# EAGLE design CAN-WiFi-GW-DevBoard (EAGLE 9.6.2)
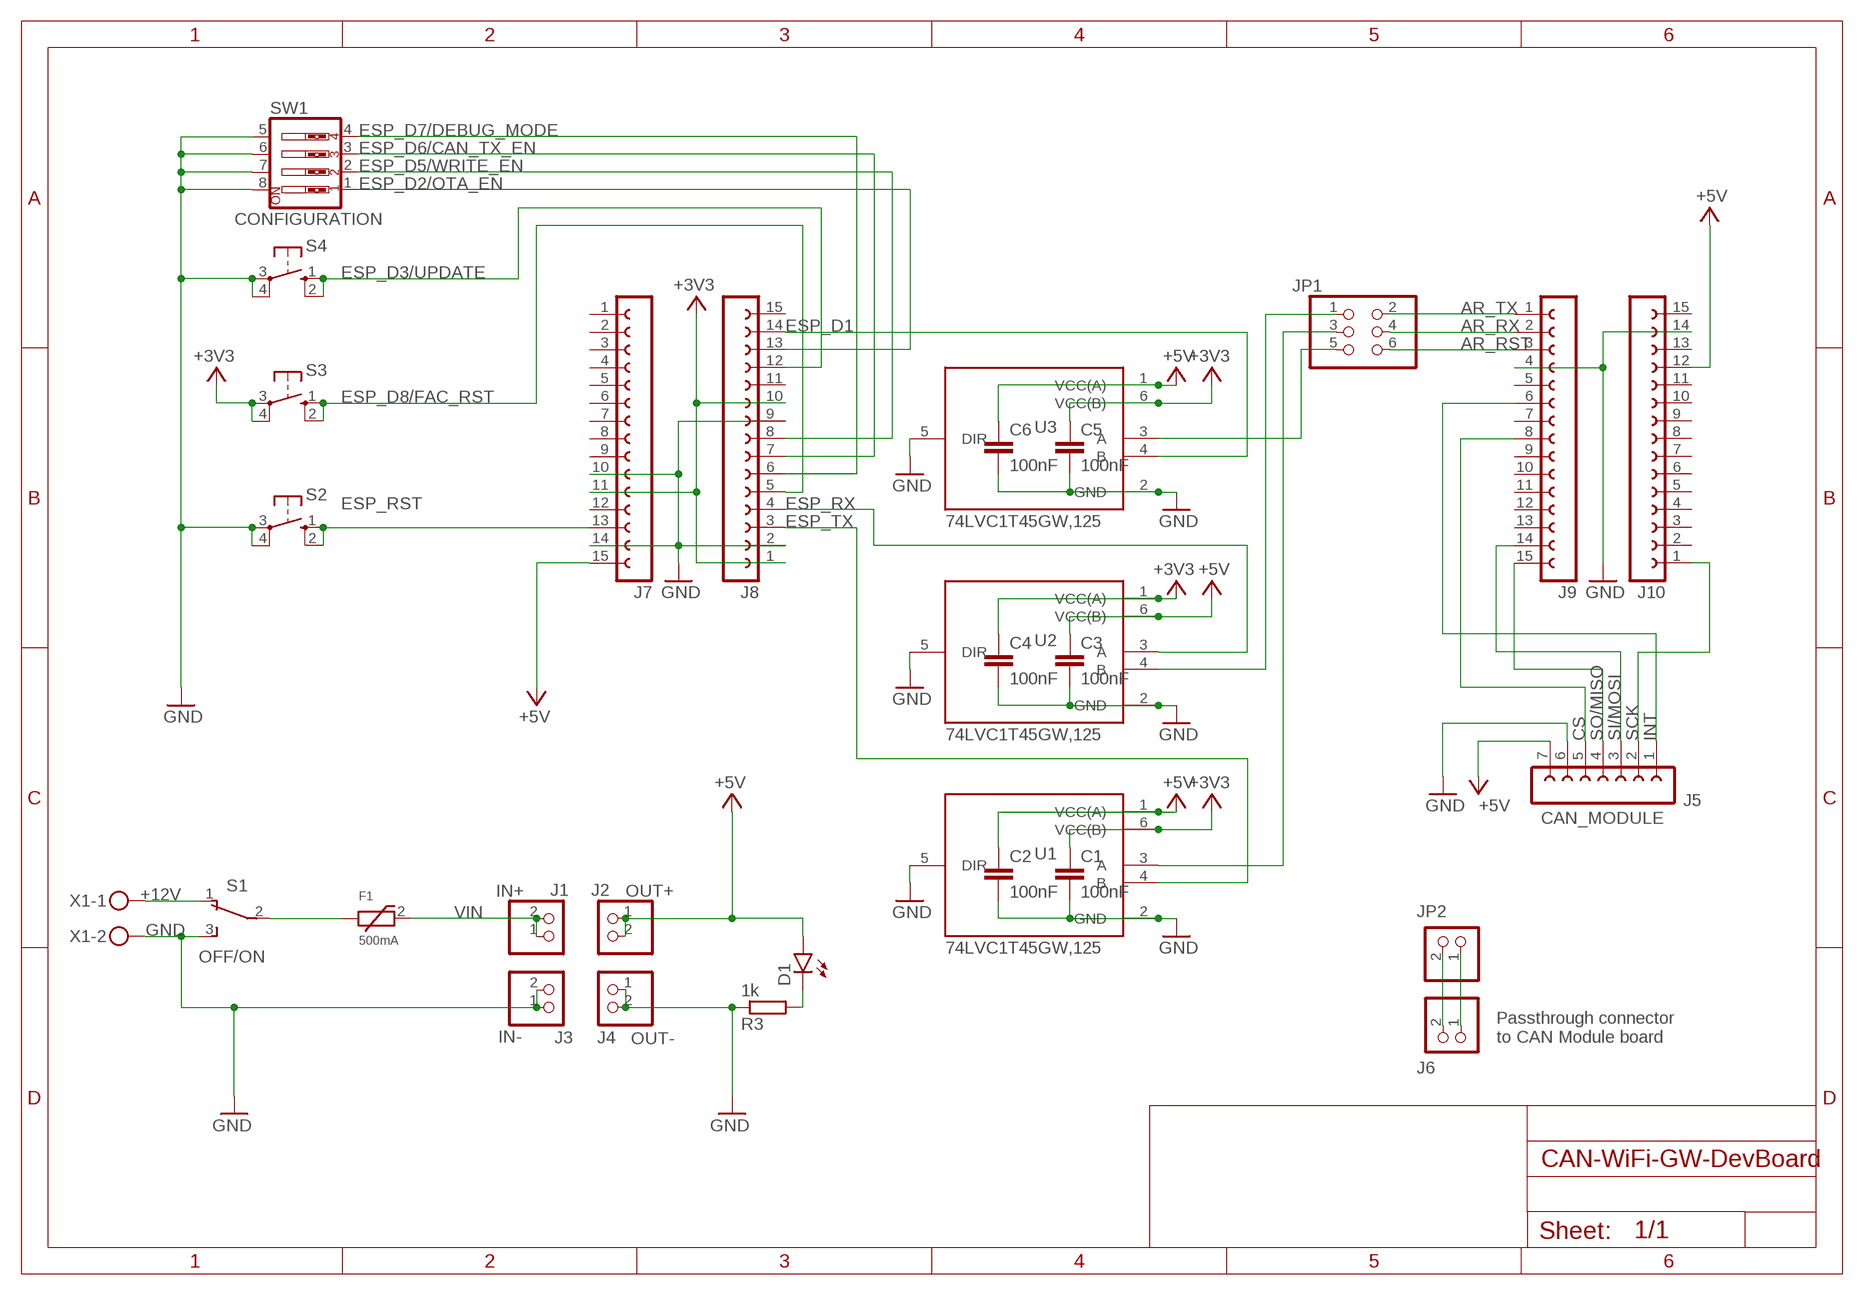
[diagram p0: schematic, sheet 1]

## Parts
C1  100nF  C-EUC1206  [C1206]
C2  100nF  C-EUC1206  [C1206]
C3  100nF  C-EUC1206  [C1206]
C4  100nF  C-EUC1206  [C1206]
C5  100nF  C-EUC1206  [C1206]
C6  100nF  C-EUC1206  [C1206]
D1  LEDSML0805  [SML0805]
F1  500mA  PTC-FUSE  [FSMD050-1210-R]
J1  IN+  PINHD-1X2  [1X02]
J2  OUT+  PINHD-1X2  [1X02]
J3  IN-  PINHD-1X2  [1X02]
J4  OUT-  PINHD-1X2  [1X02]
J5  CAN_MODULE  FE07-1  [FE07]
J6  PINHD-1X2  [1X02]
J7  FE15-1  [FE15]
J8  FE15-1  [FE15]
J9  FE15-1  [FE15]
J10  FE15-1  [FE15]
JP1  PINHD-2X3  [2X03]
JP2  PINHD-1X2  [1X02]
R3  1k  R-EU_R0805  [R0805]
S1  OFF/ON  TL36PO  [TL3XPO]
S2  10-XX  [B3F-10XX]
S3  10-XX  [B3F-10XX]
S4  10-XX  [B3F-10XX]
SW1  CONFIGURATION  SW_DIP-4  [EDG-04]
U1  74LVC1T45GW,125  [SOP65P210X110-6N]
U2  74LVC1T45GW,125  [SOP65P210X110-6N]
U3  74LVC1T45GW,125  [SOP65P210X110-6N]
X1  MKDSN1,5/2-5,08  [MKDSN1,5/2-5,08]

## Nets
+3V3: C1.1 C4.1 C5.1 J7.11 J8.1 J8.10 S3.3(P) S3.4(P1) U1.6(VCC(B)) U2.1(VCC(A)) U3.6(VCC(B))
+5V: C2.1 C3.1 C6.1 D1.A J2.1 J2.2 J5.7 J7.15 J10.12 U1.1(VCC(A)) U2.6(VCC(B)) U3.1(VCC(A))
+12V: S1.1(O) X1.1
AR_RST: J9.3 JP1.6
AR_RX: J9.2 JP1.4
AR_TX: J9.1 JP1.2
CS: J5.5 J9.8
ESP_D1: J8.14 U3.4(B)
ESP_D2/OTA_EN: J8.13 SW1.1
ESP_D3/UPDATE: J8.12 S4.1(S) S4.2(S1)
ESP_D5/WRITE_EN: J8.8 SW1.2
ESP_D6/CAN_TX_EN: J8.7 SW1.3
ESP_D7/DEBUG_MODE: J8.6 SW1.4
ESP_D8/FAC_RST: J8.5 S3.1(S) S3.2(S1)
ESP_RST: J7.13 S2.1(S) S2.2(S1)
ESP_RX: J8.4 U2.3(A)
ESP_RX_5V: JP1.1 U2.4(B)
ESP_TX: J8.3 U1.4(B)
ESP_TX_5V: JP1.3 U1.3(A)
GND: C1.2 C2.2 C3.2 C4.2 C5.2 C6.2 J3.1 J3.2 J4.1 J4.2 J5.6 J7.10 J7.14 J8.2 J8.9 J9.4 J10.14 R3.1 S1.3(S) S2.3(P) S2.4(P1) S4.3(P) S4.4(P1) SW1.5 SW1.6 SW1.7 SW1.8 U1.2(GND) U1.5(DIR) U2.2(GND) U2.5(DIR) U3.2(GND) U3.5(DIR) X1.2
INT: J5.1 J9.6
N$1: D1.C R3.2
N$2: J6.1 JP2.1
N$3: J6.2 JP2.2
N$4: F1.1 S1.2(P)
N$6: JP1.5 U3.3(A)
SCK: J5.2 J10.1
SI/MOSI: J5.3 J9.14
SO/MISO: J5.4 J9.15
VIN: F1.2 J1.1 J1.2
Unconnected: J7.1 J7.2 J7.3 J7.4 J7.5 J7.6 J7.7 J7.8 J7.9 J7.12 J8.11 J8.15 J9.5 J9.7 J9.9 J9.10 J9.11 J9.12 J9.13 J10.2 J10.3 J10.4 J10.5 J10.6 J10.7 J10.8 J10.9 J10.10 J10.11 J10.13 J10.15

## Notes on the sheet
- Passthrough connector
  to CAN Module board

## Library data of the parts
C1-C6 = rcl:C-EU: CAPACITOR, European symbol; SPICEPREFIX: C
D1 = led:LED: LED OSRAM: - CHIPLED LG R971, LG N971, LY N971, LG Q971, LY Q971, LO R971, LY R971 LH N974, LH R974 LS Q976, LO Q976, LY Q976 LO Q996 - Hyper CHIPLED LW Q18S LB Q993, LB Q99A, LB R99A - SideLED LS A670, LO A670, LY A670, LG A670, LP A670 LB A673, LV A673, LT A673, LW A673 LH A674 LY A675 LS A676, LA A676, LO A676, LY A676, LW A676 LS A679, LY A679, LG A679 - Hyper Micro SIDELED® LS Y876, LA Y876, LO Y876, LY Y876 LT Y87S - SmartLED LW L88C, LW L88S LB L89C, LB L89S, LG L890 LS L89K, LO L89K, LY L89K LS L896, LA L896, LO L896, LY L896 - TOPLED LS T670, LO T670, LY T670, LG T670, LP T670 LSG T670, LSP T670, LSY T670, LOP T670, LYG T670 LG T671, LOG T671, LSG T671 LB T673, LV T673, LT T673, LW T673 LH T674 LS T676, LA T676, LO T676, LY T676, LB T676, LH T676, LSB T676, LW T676 LB T67C, LV T67C, LT T67C, LS T67K, LO T67K, LY T67K, LW E67C LS E67B, LA E67B, LO E67B, LY E67B, LB E67C, LV E67C, LT E67C LW T67C LS T679, LY T679, LG T679 LS T770, LO T770, LY T770, LG T770, LP T770 LB T773, LV T773, LT T773, LW T773 LH T774 LS E675, LA E675, LY E675, LS T675 LS T776, LA T776, LO T776, LY T776, LB T776 LHGB T686 LT T68C, LB T68C - Hyper Mini TOPLED® LB M676 - Mini TOPLED Santana® LG M470 LS M47K, LO M47K, LY M47K Source: http://www.osram.convergy.de LUXEON: - LUMILED® LXK2-PW12-R00, LXK2-PW12-S00, LXK2-PW14-U00, LXK2-PW14-V00 LXK2-PM12-R00, LXK2-PM12-S00, LXK2-PM14-U00 LXK2-PE12-Q00, LXK2-PE12-R00, LXK2-PE12-S00, LXK2-PE14-T00, LXK2-PE14-U00 LXK2-PB12-K00, LXK2-PB12-L00, LXK2-PB12-M00, LXK2-PB14-N00, LXK2-PB14-P00, LXK2-PB14-Q00 LXK2-PR12-L00, LXK2-PR12-M00, LXK2-PR14-Q00, LXK2-PR14-R00 LXK2-PD12-Q00, LXK2-PD12-R00, LXK2-PD12-S00 LXK2-PH12-R00, LXK2-PH12-S00 LXK2-PL12-P00, LXK2-PL12-Q00, LXK2-PL12-R00 Source: www.luxeon.com KINGBRIGHT: KA-3528ASYC Source: www.kingbright.com
F1 = custom:PTC-FUSE: Surface mountable PPTC-Fuse, FSMD1210, ESKA Standard: Factory standard Connection: Pure tin Operating temperature: -40°C to 85°C (Consider de-rating) Solderability: RS 186-9E, ANSI/J-std-002 Cat,3 Ratings (@ 23°C): Art. No. IH [A] UN [V] IT [A] ttrip_max [s] Imax [A] Pd [W] R [Ω] Rmin Rmax FSMD005-1210-R 0,05 60 0,15 1,50 100 0,60 3,600 50,000 FSMD010-1210-R 0,10 60 0,25 1,50 100 0,60 1,600 15,000 FSMD020-1210-R 0,20 30 0,40 0,02 100 0,60 0,800 5,000 FSMD035-1210-R 0,35 16 0,70 0,20 100 0,60 0,320 1,300 FSMD050-1210-R 0,50 16 1,00 0,10 100 0,60 0,250 0,900 FSMD075-1210-R 0,75 8 1,50 0,10 100 0,60 0,130 0,400 FSMD075-24-1210R 0,75 24 1,50 0,10 100 0,60 0,130 0,400 FSMD110-1210R 1,10 8 2,20 0,30 100 0,80 0,060 0,210 FSMD110-16-1210R 1,10 16 2,20 0,30 100 0,80 0,060 0,210 FSMD150-1210R 1,50 6 3,00 0,50 100 0,80 0,040 0,110 FSMD175-1210R 1,75 6 4,00 0,60 100 0,80 0,020 0,080 FSMD200-1210R 2,00 6 4,00 1,00 100 0,80 0,015 0,07
J1-J4 J6 JP2 = pinhead:PINHD-1X2: PIN HEADER
J5 = con-lsta:FE07-1: FEMALE HEADER; OC_FARNELL: unknown; OC_NEWARK: unknown
J7-J10 = con-lsta:FE15-1: FEMALE HEADER; OC_FARNELL: unknown; OC_NEWARK: unknown
JP1 = pinhead:PINHD-2X3: PIN HEADER
R3 = rcl:R-EU_: RESISTOR, European symbol; SPICEPREFIX: R
S1 = switch:TL36PO: TINY SWITCH ON - ON Source: http://www2.produktinfo.conrad.com/datenblaetter/700000-724999/705152-da-01-de-Subminiaturschalter_TL_36YO.pdf
S2-S4 = switch-omron:10-XX: OMRON SWITCH; MPN: B3F-1000; OC_FARNELL: 176432; OC_NEWARK: 36M3542
SW1 = special:SW_DIP-4: DIP SWITCH
U1-U3 = 74LVC1T45GW_125:74LVC1T45GW,125: Check availability <https://pricing.snapeda.com/parts/74LVC1T45GW%2C125/Nexperia%20USA%20Inc./view-part?ref=eda>; AVAILABILITY: In Stock; DESCRIPTION: Voltage Level Translator Bidirectional 1 Circuit 1 Channel 420Mbps 6-TSSOP; MF: Nexperia USA Inc.; MP: 74LVC1T45GW,125; PACKAGE: None; PRICE: None; PURCHASE-URL: https://pricing.snapeda.com/search/part/74LVC1T45GW,125/?ref=eda
X1 = con-phoenix-508:MKDSN1,5/2-5,08: MKDSN 1,5/ 2-5,08 Printklemme Nennstrom: 13,5 A Nennspannung: 250 V Rastermaß: 5,08 mm Polzahl: 2 Anschlussart: Schraubanschluss Montage: Löten Anschlussrichtung Leiter/Platine: 0 ° Artikelnummer: 1729128 Source: http://eshop.phoenixcontact.com .. 1729128.pdf

## Net classes
0 default: clearance 0.205 mm

## Board
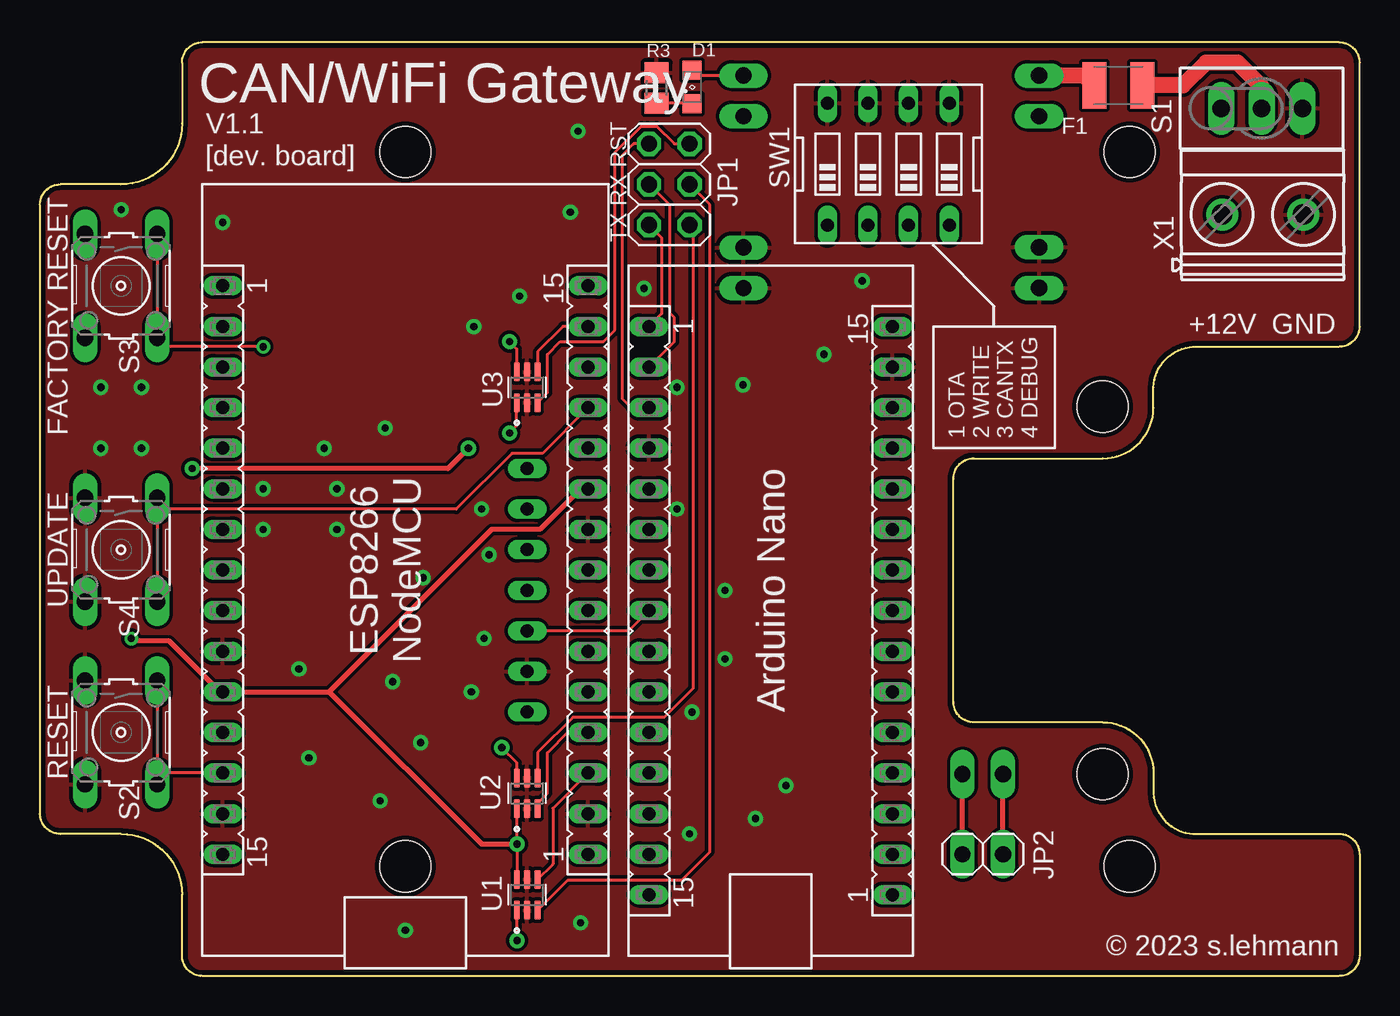
[diagram p1: board, top side]
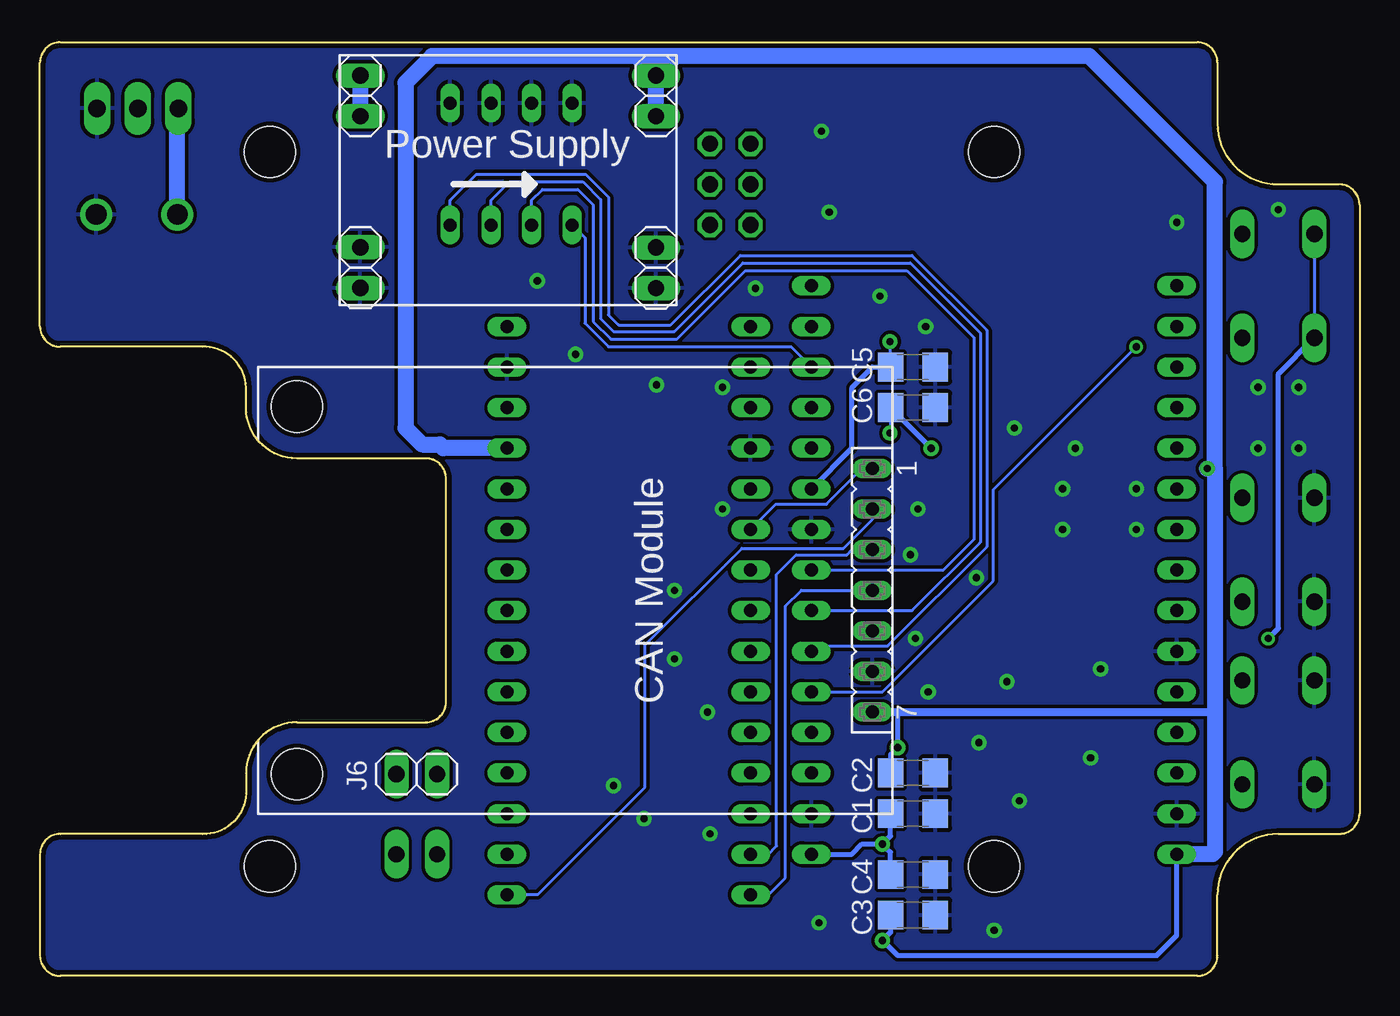
[diagram p2: board, bottom side, seen from below]

Size 82.55 x 58.42 mm. Coordinates in mm from the lower left corner, seen from the top.
Outline: 8.89,1.27 8.89,5.08 arc90 5.08,8.89 1.27,8.89 arc-90 0,10.16 0,48.26 arc-90 1.27,49.53 5.08,49.53 arc90 8.89,53.34 8.89,57.15 arc-90 10.16,58.42 81.28,58.42 arc-90 82.55,57.15 82.55,40.64 arc-90 81.28,39.37 72.39,39.37 arc90 69.66,36.83 69.66,35.56 arc-90 66.48,32.38 58.42,32.38 arc90 57.15,31.11 57.15,17.14 arc90 58.42,15.88 66.48,15.88 arc-90 69.66,12.7 69.66,11.43 arc90 72.39,8.89 81.28,8.89 arc-90 82.55,7.62 82.55,1.27 arc-90 81.28,0 10.16,0 arc-90 8.89,1.27
Copper layers (1*16): Top 0.035mm / dielectric 1.5mm / Bottom 0.035mm
Design rules "aisler_2_layer_simple": minimum track width 0.2mm, minimum drill 0.45mm, track to track 0.175mm, track to pad 0.175mm, pad to pad 0.175mm, via to via 0.175mm, smd to smd 0.175mm, copper to edge 0.3mm, drill to drill 0.25mm, minimum pad ring 0.2mm, minimum via ring 0.2mm, stop-mask expansion 0mil, vias tented up to drill 0mil, thermal gap 10mil
Holes 3.2 mm at 22.86,51.56 22.86,6.86 68.16,6.86 68.16,51.56 66.48,12.63 66.48,35.63

### Footprints (pad centres in the part's own frame; a part is rotated, then mirrored left to right if it is on the bottom)
C1206 = smd 1.6 x 1.8: 1 -1.4,0; 2 1.4,0
SML0805 = smd 1.2 x 1.2: A 1.05,0; C -1.05,0
FSMD050-1210-R = smd 1.5 x 2.9: 1 -1.5,0; 2 1.5,0
1X02 = drill 1.016 long: 1 -1.27,0; 2 1.27,0
FE07 = drill 0.813 long: 1 -7.62,0; 2 -5.08,0; 3 -2.54,0; 4 0,0; 5 2.54,0; 6 5.08,0; 7 7.62,0
FE15 = drill 0.813 long: 1 -17.78,0; 2 -15.24,0; 3 -12.7,0; 4 -10.16,0; 5 -7.62,0; 6 -5.08,0; 7 -2.54,0; 8 0,0; 9 2.54,0; 10 5.08,0; 11 7.62,0; 12 10.16,0; 13 12.7,0; 14 15.24,0; 15 17.78,0
2X03 = drill 1.016 octagon: 1 -2.54,-1.27; 2 -2.54,1.27; 3 0,-1.27; 4 0,1.27; 5 2.54,-1.27; 6 2.54,1.27
R0805 = smd 1.3 x 1.5: 1 -0.95,0; 2 0.95,0
TL3XPO = drill 1.1 pad 1.422 long: 1 -2.54,0; 2 0,0; 3 2.54,0
B3F-10XX = drill 1.016 long: 1 -3.251,2.261; 2 3.251,2.261; 3 -3.251,-2.261; 4 3.251,-2.261
EDG-04 = drill 0.813 long: 1 -3.81,-3.81; 2 -1.27,-3.81; 3 1.27,-3.81; 4 3.81,-3.81; 5 3.81,3.81; 6 1.27,3.81; 7 -1.27,3.81; 8 -3.81,3.81
SOP65P210X110-6N = smd 1.19 x 0.4: 1 -0.96,0.65; 2 -0.96,0; 3 -0.96,-0.65; 4 0.96,-0.65; 5 0.96,0; 6 0.96,0.65
MKDSN1,5/2-5,08 = drill 1.3 pad 2: 1 -2.561,0.025; 2 2.519,0.025

### Placement (x,y rotation side)
C1  27.94,10.16 0 bottom
C2  27.94,12.7 0 bottom
C3  27.94,3.81 0 bottom
C4  27.94,6.35 0 bottom
C5  27.94,38.1 0 bottom
C6  27.94,35.56 0 bottom
D1  40.8,55.62 90 top
F1  67.47,55.72 180 top
J1  62.51,55.07 90 bottom
J2  44.01,55.07 90 bottom
J3  62.51,44.32 90 bottom
J4  44.01,44.31 90 bottom
J5  30.48,24.13 270 bottom
J6  58.98,12.63 180 bottom
J7  11.43,25.4 270 top
J8  34.29,25.4 90 top
J9  38.1,22.86 270 top
J10  53.34,22.86 90 top
JP1  39.37,49.53 90 top
JP2  58.98,7.62 0 top
R3  38.58,55.56 270 top
S1  76.43,54.28 0 top
S2  5.08,15.24 270 top
S3  5.08,43.18 270 top
S4  5.08,26.67 270 top
SW1  53.07,50.8 0 top
U1  30.48,5.08 90 top
U2  30.48,11.43 90 top
U3  30.48,36.83 90 top
X1  76.52,47.62 0 top

### Tracks (layer width: path | path; a pad name or v marks a point on that pad's centre or on a via)
+3V3  (via drill 0.45, 0.45 pad 0.95)
  Top 0.203: U2.1 29.84,10.46 v29.84,8.26 29.84,6.05 U1.6 | v29.37,39.69 29.83,39.23 U3.6
  Top 0.305: 18.09,17.78 J7.11 11.27,17.78 8.1,20.95 5.87,20.95 v5.71,21.11 | v29.84,8.26 27.62,8.26 18.09,17.78 | J8.10 33.81,30.48 31.27,27.94 28.25,27.94 18.09,17.78
  Bottom 0.203: C5.1 29.34,39.66 v29.37,39.69 | S3.3 S3.4
  Bottom 0.305: J8.1 31.75,7.62 31.11,8.26 v29.84,8.26 | C5.1 30.48,38.1 31.75,36.83 31.75,33.02 J8.10 | C4.1 29.34,7.75 v29.84,8.26 | v29.84,8.26 29.34,8.76 C1.1 | v5.71,21.11 5.08,21.75 5.08,37.67 S3.4
+5V  (via drill 0.45 pad 0.95)
  Top 0.203: v29.84,2.22 29.84,4.11 U1.1 | v28.89,14.29 29.83,13.35 U2.6 | v29.37,33.97 29.83,34.43 U3.1 | J2.2 41.13,56.34 D1.A
  Top 0.305: v26.8,33.02 25.53,31.75 v9.53,31.75
  Bottom 0.203: C6.1 29.34,34 v29.37,33.97
  Bottom 0.305: C2.1 29.34,13.84 v28.89,14.29 28.89,16.51 | C6.1 v26.8,33.02 | C3.1 29.34,2.73 v29.84,2.22 28.89,1.27 12.7,1.27 11.43,2.54 J7.15
  Bottom 0.508: J5.7 28.89,16.51 9.05,16.51
  Bottom 1.016: J2.1 J2.2 | 9.05,31.75 9.05,16.51 9.05,7.78 9.21,7.62 J7.15 | v9.53,31.75 9.05,31.75 | 42.8,57.55 16.91,57.55 9.05,49.69 9.05,31.75 | 42.8,57.55 45.22,57.55 | 42.8,57.55 J2.2 | J2.2 45.22,57.55 | 45.22,57.55 58.02,57.55 59.69,55.88 59.69,34.29 58.66,33.26 57.55,33.26 57.31,33.02 J10.12
+12V
  Bottom 1.016: X1.1 73.96,54.22 S1.1
AR_RST
  Top 0.203: J9.3 36.99,35.56 36.41,36.13 36.41,51.34 37.15,52.07 JP1.6
AR_RX
  Top 0.203: J9.2 39.69,39.69 39.69,41.19 39.41,41.47 39.41,48.22 JP1.4
AR_TX
  Top 0.203: J9.1 38.89,41.43 38.89,46.2 JP1.2
CS
  Top 0.203: J9.8 36.83,21.59 J5.5
ESP_D1
  Top 0.203: J8.14 32.71,40.64 31.13,39.06 U3.4
ESP_D2/OTA_EN
  Bottom 0.203: SW1.1 48.47,46.2 48.47,40.85 46.99,39.37 35.56,39.37 J8.13
ESP_D3/UPDATE
  Top 0.203: J8.12 31.43,32.7 29.53,32.7 26.04,29.21 8.05,29.21 S4.1 S4.2
ESP_D5/WRITE_EN
  Bottom 0.203: J8.8 26.04,25.4 24.13,27.3 24.13,39.95 28.32,44.13 38.42,44.13 42.7,39.85 46.83,39.85 47.94,40.96 47.94,48.26 48.9,49.21 51.12,49.21 51.8,48.53 SW1.2
ESP_D6/CAN_TX_EN
  Bottom 0.203: J8.7 28,22.86 23.72,27.14 23.72,40.23 28.1,44.61 38.58,44.61 42.86,40.32 46.67,40.32 47.47,41.12 47.47,48.58 48.58,49.69 53.18,49.69 54.34,48.53 SW1.3
ESP_D7/DEBUG_MODE
  Bottom 0.203: J8.6 33.97,20.64 29.53,20.64 29.49,20.67 23.31,26.85 23.31,40.4 28,45.09 38.73,45.09 43.09,40.73 46.35,40.73 46.99,41.37 46.99,48.74 48.42,50.16 55.24,50.16 56.88,48.53 SW1.4
ESP_D8/FAC_RST  (via drill 0.45)
  Top 0.203: v13.97,39.37 7.9,39.37 S3.2 S3.1
  Bottom 0.203: v13.97,39.37 22.91,30.43 22.91,24.72 29.84,17.78 J8.5
ESP_RST
  Top 0.203: S2.1 S2.2 8.05,12.7 J7.13
ESP_RX
  Top 0.203: U2.3 31.13,10.81 31.75,11.43 31.75,13.97 33.02,15.24 J8.4
ESP_RX_5V
  Top 0.203: U2.4 31.13,13.98 33.34,16.19 39.05,16.19 40.87,18.01 40.87,46.76 JP1.1
ESP_TX
  Top 0.203: J8.3 32.08,10.49 32.08,6.99 U1.4
ESP_TX_5V
  Top 0.203: JP1.3 41.91,48.26 41.91,7.78 40.13,6 33.01,6 U1.3
GND  (via drill 0.45 pad 0.95)
  other vias: 42.86,24.13 40.8,16.51 18.57,30.48 21.59,34.29 16.83,13.65 13.97,30.48 13.97,27.94 43.97,36.99 22.07,18.41 46.67,11.91 44.77,9.84 23.81,14.61 16.19,19.21 17.78,33.02 18.57,27.94 6.35,36.83 6.35,33.02 3.81,33.02 3.81,36.83 23.97,24.92 27.78,21.11 26.99,17.78 28.1,26.35 27.62,29.21 42.86,19.84 40.64,8.89 51.44,43.5 39.85,36.83 30,42.55 27.15,40.64 33.66,52.86 33.18,47.78 37.78,43.02 39.85,29.21 11.43,47.15 5.08,47.94 49.05,38.89 22.86,2.86 33.81,3.33 21.27,10.95
  pour Top: 0,58.42 82.55,58.42 82.55,0 0,0
  pour Bottom: 0,58.42 82.55,58.42 82.55,0 0,0
INT
  Bottom 0.203: J9.6 36.51,29.53 33.34,29.53 31.11,31.75 J5.1
N$1
  Top 0.203: D1.C 40.76,54.61 R3.2
N$2
  Top 0.305: JP2.1 J6.1
N$3
  Top 0.305: JP2.2 J6.2
N$4
  Top 1.016: S1.2 76.43,55.65 74.93,57.15 72.94,57.15 71.51,55.72 F1.1
N$6
  Top 0.203: U3.3 31.75,36.49 31.75,38.89 32.54,39.69 35.24,39.69 35.98,40.42 35.98,51.53 37.62,53.18 38.02,53.18 38.58,53.18 39.69,52.07 JP1.5
SCK
  Bottom 0.203: J10.1 51.44,5.08 44.71,11.81 44.71,20.7 38.65,26.76 32.29,26.76 30.48,28.57 J5.2
SI/MOSI
  Bottom 0.203: J9.14 36.99,7.62 36.47,8.14 36.47,25.12 35.24,26.35 32.07,26.35 31.75,26.67 J5.3
SO/MISO
  Bottom 0.203: J9.15 36.99,5.08 35.92,6.15 35.92,23.14 34.92,24.13 J5.4
VIN
  Top 1.016: F1.2 65.35,56.34 J1.2
  Bottom 1.016: J1.2 J1.1

### Text on the board
tPlace: CAN/WiFi Gateway | V1.1 | [dev. board] | 1 OTA / 2 WRITE / 3 CANTX / 4 DEBUG | ESP8266 / NodeMCU | Arduino Nano | © 2023 s.lehmann
bPlace: Power Supply | CAN Module
tNames: TX RX RST | FACTORY RESET | +12V | GND | UPDATE | RESET